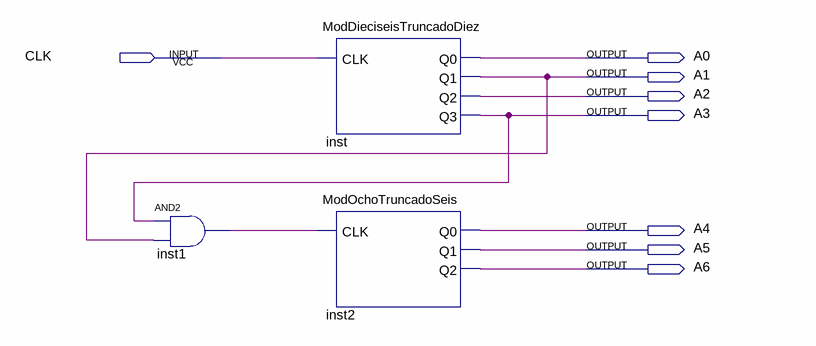
[diagram p0: schematic sheet]
// Quartus schematic RelojSegundero.bdf as structural Verilog: 3 symbols, 8 pins
module RelojSegundero (
  input  CLK,
  output A0,
  output A1,
  output A2,
  output A3,
  output A4,
  output A5,
  output A6
);

  wire inst1_out;

  and inst1 (inst1_out, A3, A1);
  ModDieciseisTruncadoDiez inst (.CLK(CLK), .Q0(A0), .Q1(A1), .Q2(A2), .Q3(A3));
  ModOchoTruncadoSeis inst2 (.CLK(inst1_out), .Q0(A4), .Q1(A5), .Q2(A6));
endmodule
